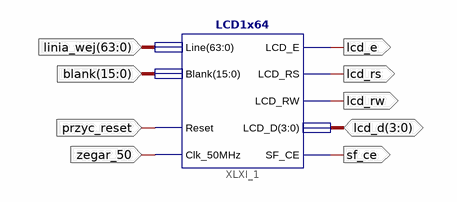
[diagram p0: schematic sheet 1]
// Xilinx ISE schematic DISPLAY.sch (spartan3e) as structural Verilog: 1 symbols, 9 ports
module DISPLAY (
  input  zegar_50,
  input  przyc_reset,
  input  [63:0] linia_wej,
  input  [15:0] blank,
  inout  [3:0] lcd_d,
  output lcd_e,
  output lcd_rw,
  output lcd_rs,
  output sf_ce
);

  LCD1x64 XLXI_1 (
    .Clk_50MHz(zegar_50), .Reset(przyc_reset), .Line(linia_wej), .Blank(blank), .LCD_D(lcd_d), .LCD_E(lcd_e),
    .LCD_RW(lcd_rw), .LCD_RS(lcd_rs), .SF_CE(sf_ce));
endmodule
